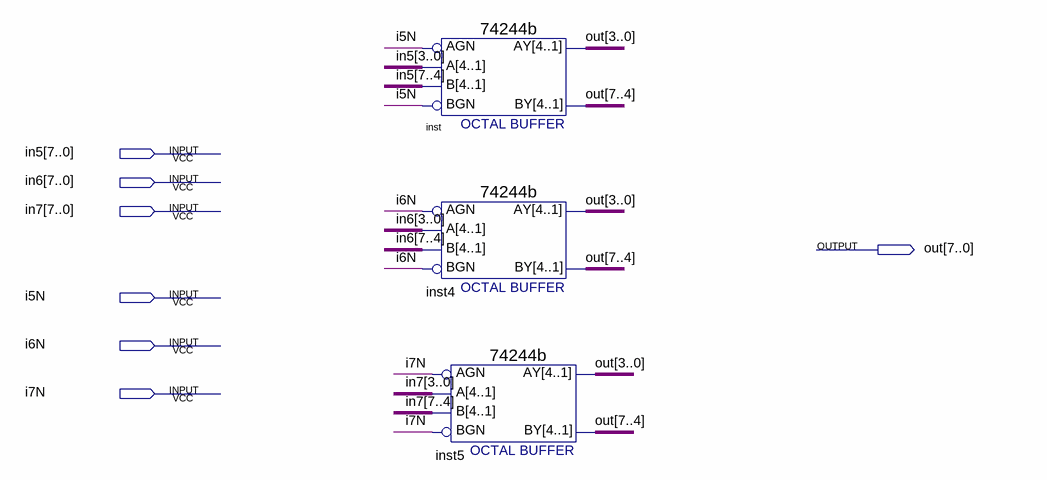
[diagram p0: schematic sheet]
// Quartus schematic Mux3_1.bdf as structural Verilog: 3 symbols, 7 pins
module Mux3_1 (
  input  [7:0] in5,
  input  [7:0] in6,
  input  [7:0] in7,
  input  i5N,
  input  i6N,
  input  i7N,
  output [7:0] out
);

  \74244b  inst (.AGN(i5N), .B(in5[7:4]), .BGN(i5N), .A(in5[3:0]), .AY(out[3:0]), .BY(out[7:4]));
  \74244b  inst4 (.AGN(i6N), .B(in6[7:4]), .BGN(i6N), .A(in6[3:0]), .AY(out[3:0]), .BY(out[7:4]));
  \74244b  inst5 (.AGN(i7N), .B(in7[7:4]), .BGN(i7N), .A(in7[3:0]), .AY(out[3:0]), .BY(out[7:4]));
endmodule
